# EAGLE design fnir_motherboard (EAGLE 6.1)
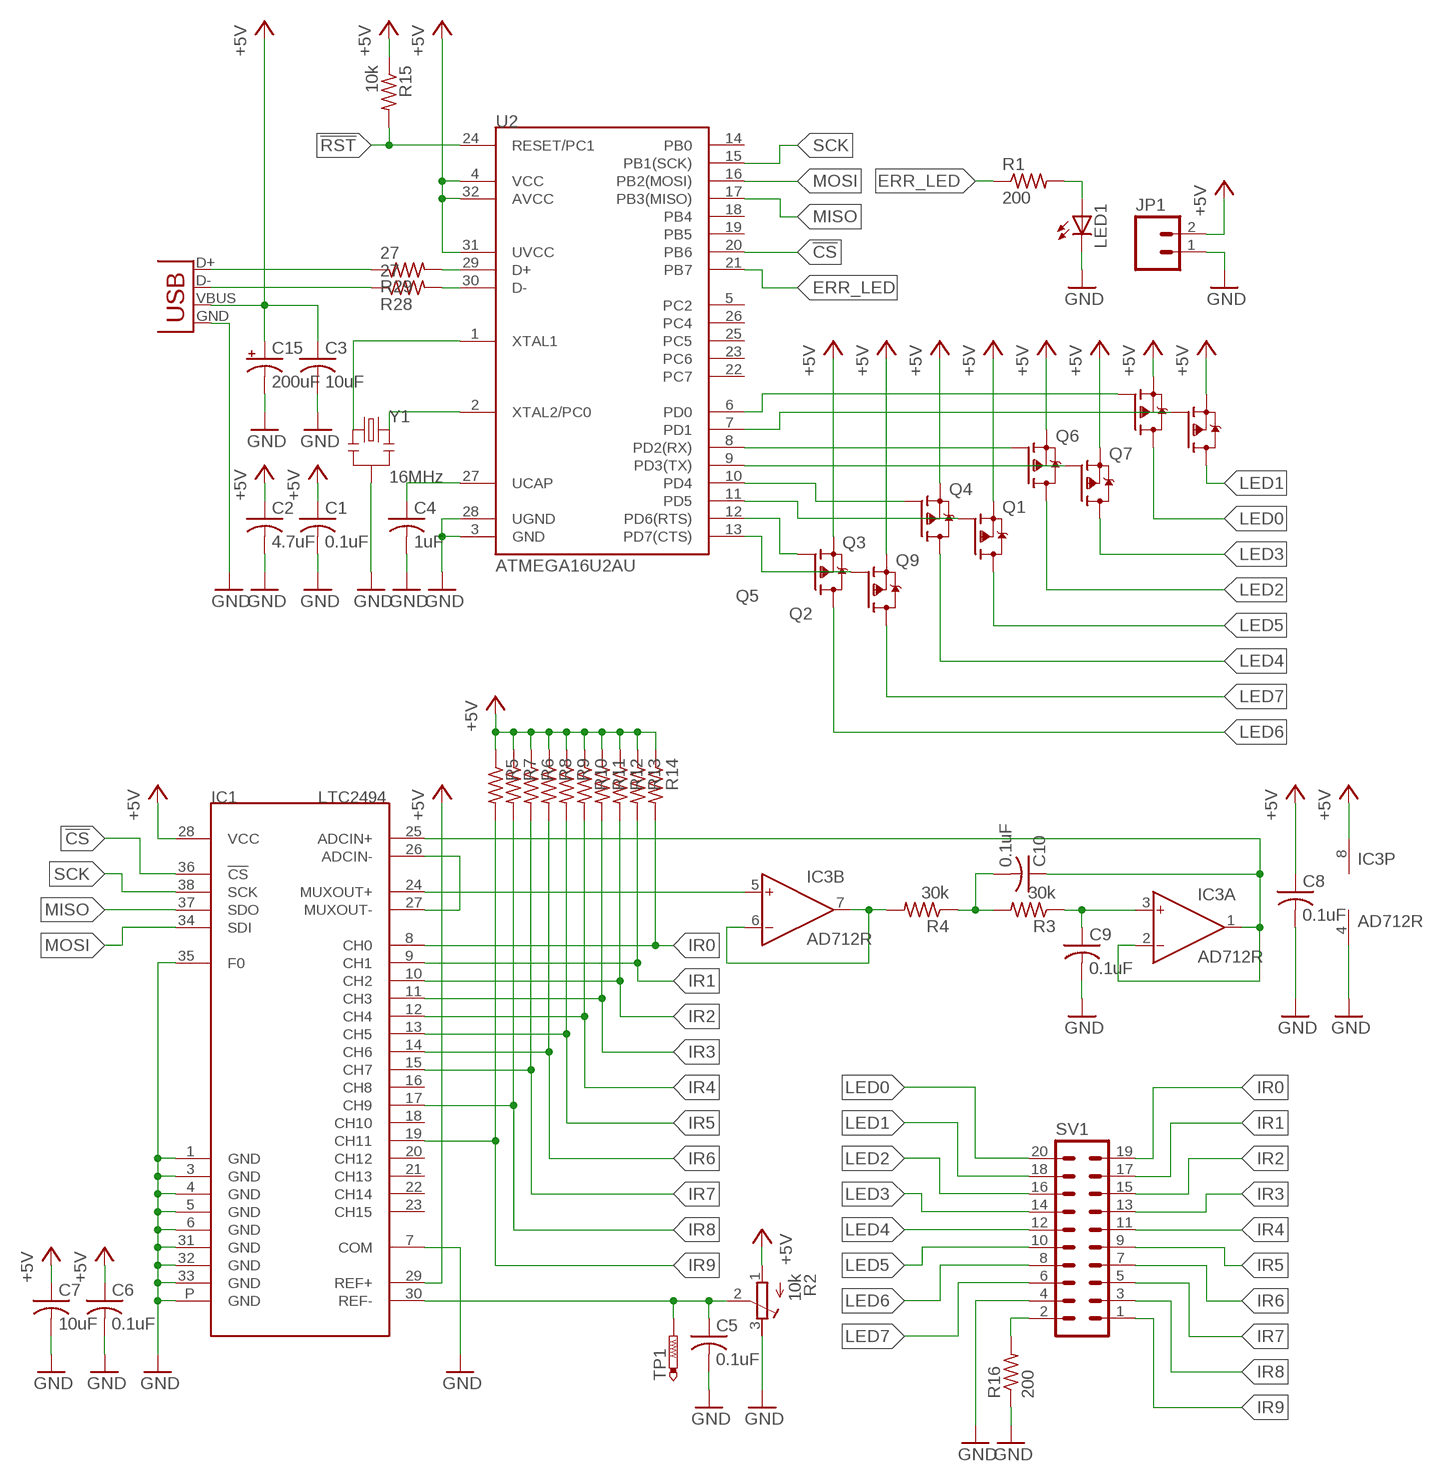
[diagram p0: schematic, sheet 1]

## Parts
C1  0.1uF  C-USC1206  [C1206]
C2  4.7uF  C-USC1206  [C1206]
C3  10uF  C-USC1206  [C1206]
C4  1uF  C-USC1206  [C1206]
C5  0.1uF  C-USC1206  [C1206]
C6  0.1uF  C-USC1206  [C1206]
C7  10uF  C-USC1206  [C1206]
C8  0.1uF  C-USC1206  [C1206]
C9  0.1uF  C-USC1206  [C1206]
C10  0.1uF  C-USC1206  [C1206]
C15  200uF  CPOL-USD  [PANASONIC_D]
IC1  LTC2494  [QFN38-7X12]
IC3  AD712R  [SO8]
JP1  M02PTH  [1X02]
LED1  LEDCHIPLED_1206  [CHIPLED_1206]
Q1  TRANSISTOR_FET_TSM2301CX  [SOT-23]
Q2  TRANSISTOR_FET_TSM2301CX  [SOT-23]
Q3  TRANSISTOR_FET_TSM2301CX  [SOT-23]
Q4  TRANSISTOR_FET_TSM2301CX  [SOT-23]
Q5  TRANSISTOR_FET_TSM2301CX  [SOT-23]
Q6  TRANSISTOR_FET_TSM2301CX  [SOT-23]
Q7  TRANSISTOR_FET_TSM2301CX  [SOT-23]
Q9  TRANSISTOR_FET_TSM2301CX  [SOT-23]
R1  200  R-US_R1206  [R1206]
R2  10k  R-TRIMM3304W  [RTRIM3304W]
R3  30k  R-US_R1206  [R1206]
R4  30k  R-US_R1206  [R1206]
R5  R-US_R1206  [R1206]
R6  R-US_R1206  [R1206]
R7  R-US_R1206  [R1206]
R8  R-US_R1206  [R1206]
R9  R-US_R1206  [R1206]
R10  R-US_R1206  [R1206]
R11  R-US_R1206  [R1206]
R12  R-US_R1206  [R1206]
R13  R-US_R1206  [R1206]
R14  R-US_R1206  [R1206]
R15  10k  R-US_R1206  [R1206]
R16  200  R-US_R1206  [R1206]
R28  27  R-US_R1206  [R1206]
R29  27  R-US_R1206  [R1206]
SV1  MA10-2  [MA10-2]
TP1  PTR1B1,27  [B1,27]
U2  ATMEGA16U2AU  ATMEGA8U2AU  [TQFP32-08]
X2  USB-SMD-NS  [USB-MINIB-NOSTOP]
Y1  16MHz  RESONATORSMD  [RESONATOR-SMD]

## Nets
!CS: IC1.36(!CS) U2.20(PB6)
!RST: R15.2 U2.24(RESET/PC1)
+5V: C1.1 C2.1 C3.1 C6.1 C7.1 C8.1 C15.+ IC1.28(VCC) IC1.29(REF+) IC3.8(P:V+) JP1.2 Q1.2(S) Q2.2(S) Q3.2(S) Q4.2(S) Q5.2(S) Q6.2(S) Q7.2(S) Q9.2(S) R2.1(A) R5.1 R6.1 R7.1 R8.1 R9.1 R10.1 R11.1 R12.1 R13.1 R14.1 R15.1 U2.4(VCC) U2.31(UVCC) U2.32(AVCC) X2.VBUS
D+: R29.1 X2.D+
D-: R28.1 X2.D-
ERR_LED: R1.1 U2.21(PB7)
GND: C1.2 C2.2 C3.2 C4.2 C5.2 C6.2 C7.2 C8.2 C9.2 C15.- IC1.1(GND) IC1.3(GND) IC1.4(GND) IC1.5(GND) IC1.6(GND) IC1.7(COM) IC1.31(GND) IC1.32(GND) IC1.33(GND) IC1.35(F0) IC1.P(GND) IC3.4(P:V-) JP1.1 LED1.C R2.3(E) R16.1 SV1.4 U2.3(GND) U2.28(UGND) X2.GND Y1.2
IR0: IC1.8(CH0) R14.2 SV1.19
IR1: IC1.9(CH1) R13.2 SV1.17
IR2: IC1.10(CH2) R12.2 SV1.15
IR3: IC1.11(CH3) R11.2 SV1.13
IR4: IC1.12(CH4) R10.2 SV1.11
IR5: IC1.13(CH5) R9.2 SV1.9
IR6: IC1.14(CH6) R8.2 SV1.7
IR7: IC1.15(CH7) R6.2 SV1.5
IR8: IC1.17(CH9) R7.2 SV1.3
IR9: IC1.19(CH11) R5.2 SV1.1
LED0: Q6.3(D) SV1.20
LED1: Q7.3(D) SV1.18
LED2: Q4.3(D) SV1.16
LED3: Q1.3(D) SV1.14
LED4: Q3.3(D) SV1.12
LED5: Q9.3(D) SV1.10
LED6: Q5.3(D) SV1.8
LED7: Q2.3(D) SV1.6
MISO: IC1.37(SDO) U2.17(PB3(MISO))
MOSI: IC1.34(SDI) U2.16(PB2(MOSI))
N$1: Q2.1(G) U2.13(PD7(CTS))
N$2: Q1.1(G) U2.9(PD3(TX))
N$3: Q9.1(G) U2.11(PD5)
N$4: Q4.1(G) U2.8(PD2(RX))
N$5: Q5.1(G) U2.12(PD6(RTS))
N$6: Q7.1(G) U2.7(PD1)
N$7: Q6.1(G) U2.6(PD0)
N$8: Q3.1(G) U2.10(PD4)
N$9: IC1.26(ADCIN-) IC1.27(MUXOUT-)
N$10: IC1.24(MUXOUT+) IC3.5(B:IN+)
N$11: C10.1 IC1.25(ADCIN+) IC3.1(A:OUT) IC3.2(A:IN-)
N$12: C5.1 IC1.30(REF-) R2.2(S) TP1.TP
N$13: C9.1 IC3.3(A:IN+) R3.1
N$14: R28.2 U2.30(D-)
N$15: R29.2 U2.29(D+)
N$16: C10.2 R3.2 R4.1
N$17: C4.1 U2.27(UCAP)
N$18: IC3.6(B:IN-) IC3.7(B:OUT) R4.2
N$19: U2.2(XTAL2/PC0) Y1.3
N$20: U2.1(XTAL1) Y1.1
N$21: LED1.A R1.2
N$23: R16.2 SV1.2
SCK: IC1.38(SCK) U2.15(PB1(SCK))
Unconnected: IC1.16(CH8) IC1.18(CH10) IC1.20(CH12) IC1.21(CH13) IC1.22(CH14) IC1.23(CH15) U2.5(PC2) U2.14(PB0) U2.18(PB4) U2.19(PB5) U2.22(PC7) U2.23(PC6) U2.25(PC5) U2.26(PC4)

## Library data of the parts
C1-C10 = adafruit:C-US: CAPACITOR, American symbol
C15 = adafruit:CPOL-US: POLARIZED CAPACITOR, American symbol
IC1 = linear-technology:LTC2494: 16 bit 16 ch adc
IC3 = analog-devices:AD712: Dual Precision, Low Cost, High Speed BiFET Op Amp Source: http://www.analog.com/static/imported-files/data_sheets/AD712.pdf; MF: ALTERA CORPORATION; MPN: AD712KRZ; OC_FARNELL: 1263975; OC_NEWARK: 59K4556
JP1 = sparkfun:M02: Header 2 Standard 2-pin 0.1" header. Use with straight break away headers (SKU : PRT-00116), right angle break away headers (PRT-00553), swiss pins (PRT-00743), machine pins (PRT-00117), and female headers (PRT-00115). Molex polarized connector foot print use with SKU : PRT-08233 with associated crimp pins and housings.
LED1 = adafruit:LED: LED OSRAM: - CHIPLED LG R971, LG N971, LY N971, LG Q971, LY Q971, LO R971, LY R971 LH N974, LH R974 LS Q976, LO Q976, LY Q976 LO Q996 - Hyper CHIPLED LW Q18S LB Q993, LB Q99A, LB R99A - SideLED LS A670, LO A670, LY A670, LG A670, LP A670 LB A673, LV A673, LT A673, LW A673 LH A674 LY A675 LS A676, LA A676, LO A676, LY A676, LW A676 LS A679, LY A679, LG A679 - Hyper Micro SIDELED® LS Y876, LA Y876, LO Y876, LY Y876 LT Y87S - SmartLED LW L88C, LW L88S LB L89C, LB L89S, LG L890 LS L89K, LO L89K, LY L89K LS L896, LA L896, LO L896, LY L896 - TOPLED LS T670, LO T670, LY T670, LG T670, LP T670 LSG T670, LSP T670, LSY T670, LOP T670, LYG T670 LG T671, LOG T671, LSG T671 LB T673, LV T673, LT T673, LW T673 LH T674 LS T676, LA T676, LO T676, LY T676, LB T676, LH T676, LSB T676, LW T676 LB T67C, LV T67C, LT T67C, LS T67K, LO T67K, LY T67K, LW E67C LS E67B, LA E67B, LO E67B, LY E67B, LB E67C, LV E67C, LT E67C LW T67C LS T679, LY T679, LG T679 LS T770, LO T770, LY T770, LG T770, LP T770 LB T773, LV T773, LT T773, LW T773 LH T774 LS E675, LA E675, LY E675, LS T675 LS T776, LA T776, LO T776, LY T776, LB T776 LHGB T686 LT T68C, LB T68C - Hyper Mini TOPLED® LB M676 - Mini TOPLED Santana® LG M470 LS M47K, LO M47K, LY M47K Source: http://www.osram.convergy.de/
Q1-Q7 Q9 = dp_devices:TRANSISTOR_FET_TSM2301CX: 20V P-Channel Enhancement Mode MOSFET
R1 R3-R16 R28 R29 = adafruit:R-US_: RESISTOR, American symbol
R2 = rcl:R-TRIMM: Trimm resistor
SV1 = con-lstb:MA10-2: PIN HEADER; OC_FARNELL: unknown; OC_NEWARK: unknown
TP1 = testpad:PTR1: TEST PIN
U2 = sparkfun:ATMEGA8U2: Atmel 8-bit Microcontroller with 8/16/32K Bystes of ISP Flash and USB Controller. ATmega8U2, ATmega16U2, and ATmega32U2
X2 = sparkfun:USB: USB Connectors USB-B-PTH is fully proven SKU : PRT-00139 USB-miniB is fully proven SKU : PRT-00587 USB-A-PCB is untested. USB-A-H is throughly reviewed, but untested. Spark Fun Electronics SKU : PRT-00437 USB-B-SMT is throughly reviewed, but untested. Needs silkscreen touching up. USB-A-S has not been used/tested USB-MB-H has not been used/tested
Y1 = sparkfun:RESONATOR: Resonator Small SMD resonator. This is the itty bitty 10/20MHz resonators with built in caps. CSTCE10M0G55 and CSTCE20M0V53. Footprint has been reviewed closely but hasn't been tested yet.

## Board
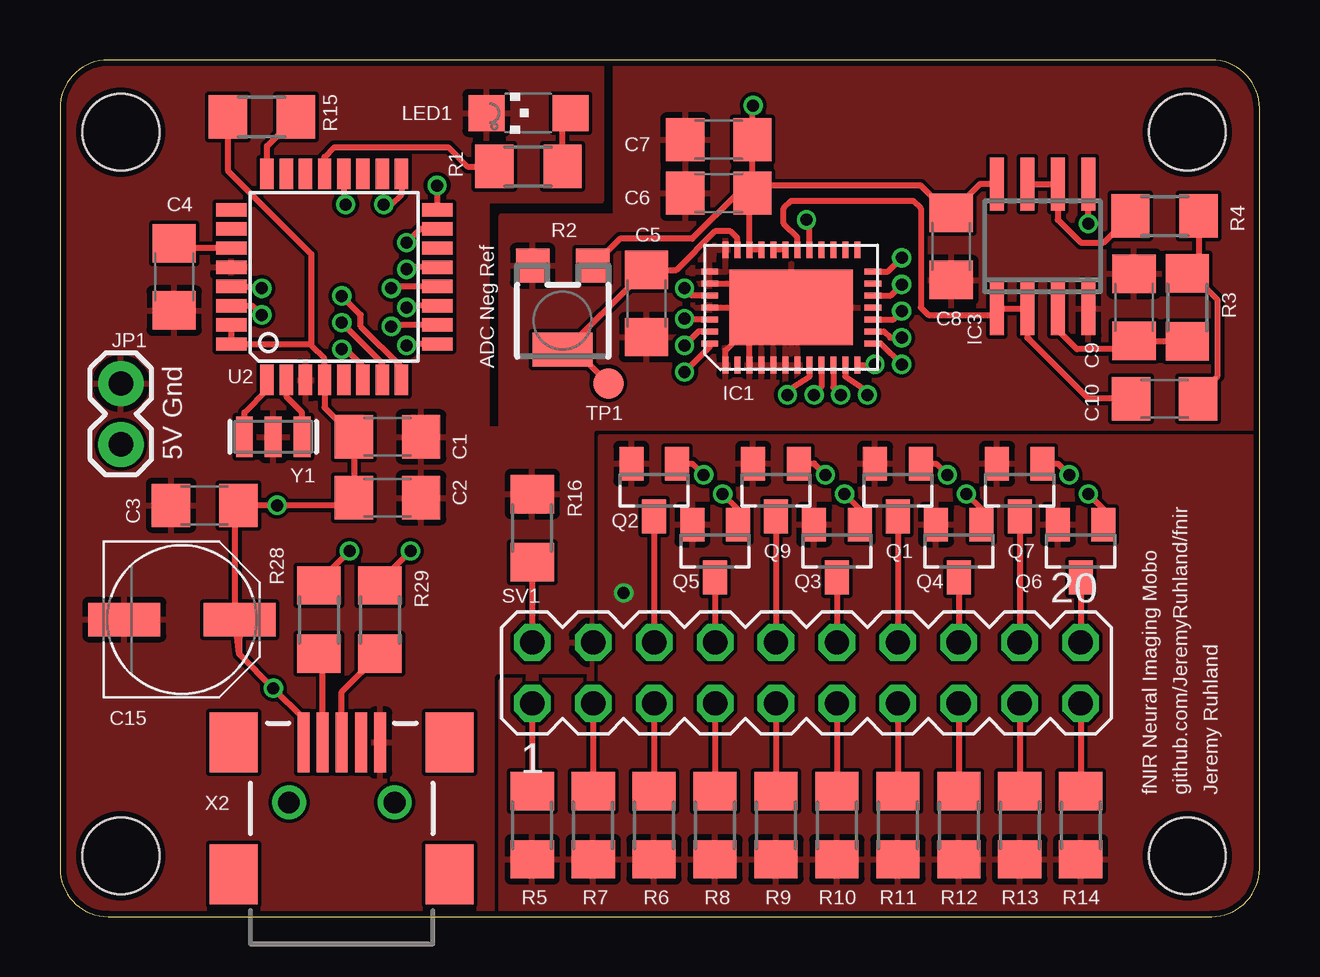
[diagram p1: board, top side]
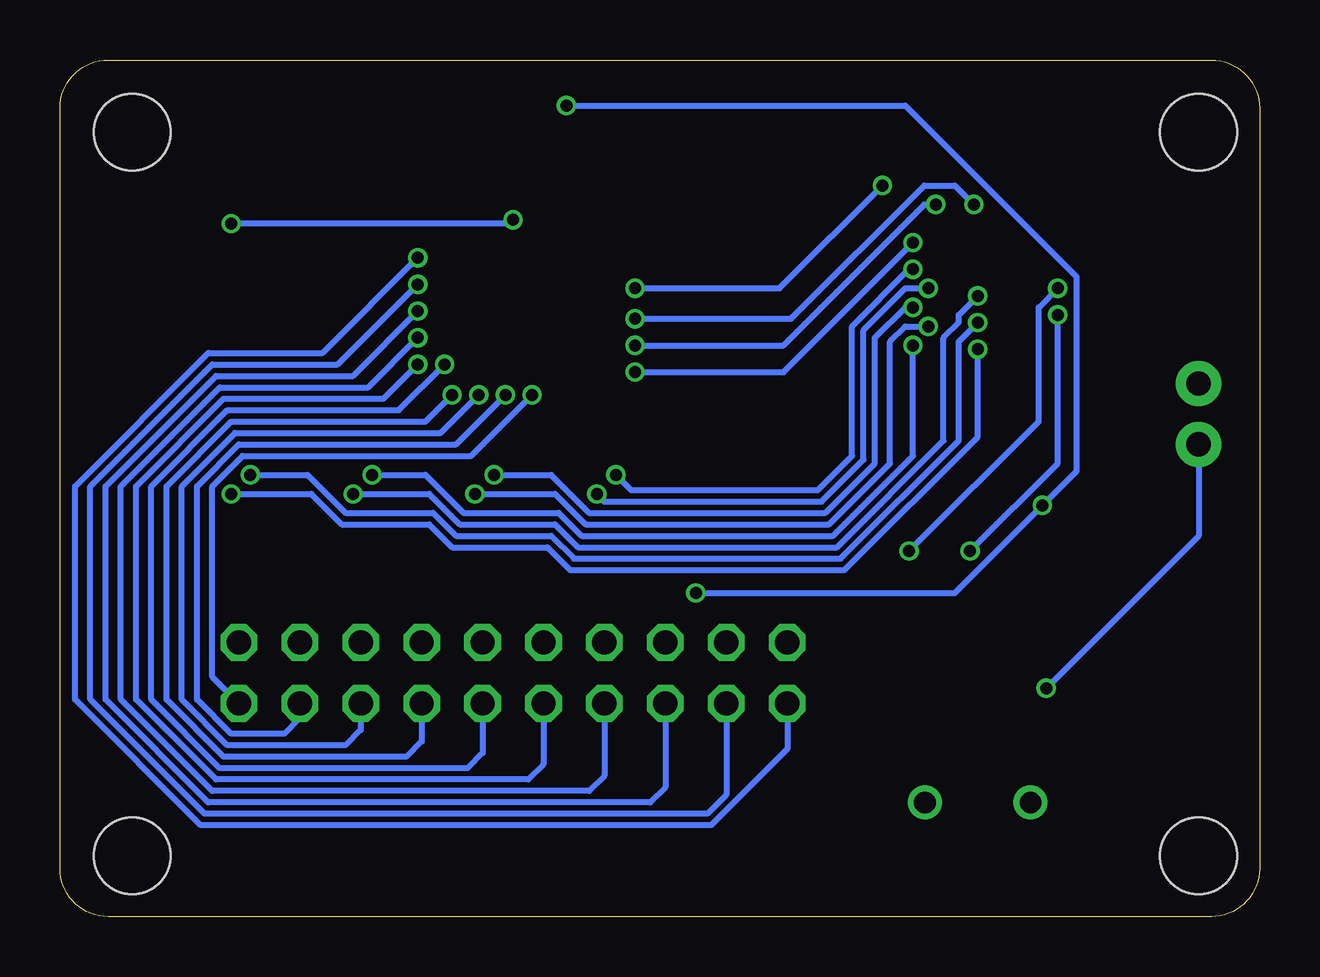
[diagram p2: board, bottom side, seen from below]

Size 50 x 35.71 mm. Coordinates in mm from the lower left corner, seen from the top.
Outline: 48,35.71 2,35.71 arc90 0,33.71 0,2 arc90 2,0 48,0 arc90 50,2 50,33.71 arc90 48,35.71
Copper layers (1*16): Top 0.035mm / dielectric 1.5mm / Bottom 0.035mm
Design rules: minimum track width 6mil, minimum drill 12mil, track to track 6mil, track to pad 6mil, pad to pad 6mil, via to via 6mil, smd to smd 0mil, copper to edge 10mil, drill to drill 10mil, minimum pad ring 10mil, minimum via ring 6mil, stop-mask expansion 2mil, vias tented up to drill 100mil, thermal gap 10mil
Holes 3.2 mm at 46.99,2.54 2.54,2.54 2.54,32.7 46.99,32.7

### Footprints (pad centres in the part's own frame; a part is rotated, then mirrored left to right if it is on the bottom)
C1206 = smd 1.6 x 1.8: 1 -1.4,0; 2 1.4,0
PANASONIC_D = smd 3 x 1.4: + 2.4,0; - -2.4,0
QFN38-7X12 = smd 0.25 x 0.7: 1 -2.75,-2.4; 2 -2.25,-2.4; 3 -1.75,-2.4; 4 -1.25,-2.4; 5 -0.75,-2.4; 6 -0.25,-2.4; 7 0.25,-2.4; 8 0.75,-2.4; 9 1.25,-2.4; 10 1.75,-2.4; 11 2.25,-2.4; 12 2.75,-2.4; 20 2.75,2.4; 21 2.25,2.4; 22 1.75,2.4; 23 1.25,2.4; 24 0.75,2.4; 25 0.25,2.4; 26 -0.25,2.4; 27 -0.75,2.4; 28 -1.25,2.4; 29 -1.75,2.4; 30 -2.25,2.4; 31 -2.75,2.4 | smd 0.7 x 0.25: 13 3.4,-1.5; 14 3.4,-1; 15 3.4,-0.5; 16 3.4,0; 17 3.4,0.5; 18 3.4,1; 19 3.4,1.5; 32 -3.4,1.5; 33 -3.4,1; 34 -3.4,0.5; 35 -3.4,0; 36 -3.4,-0.5; 37 -3.4,-1; 38 -3.4,-1.5 | smd 5.15 x 3.15: P 0,0
SO8 = smd 0.6 x 2.2: 1 -1.905,-2.6; 2 -0.635,-2.6; 3 0.635,-2.6; 4 1.905,-2.6; 5 1.905,2.6; 6 0.635,2.6; 7 -0.635,2.6; 8 -1.905,2.6
1X02 = drill 1.016 pad 1.88: 1 0,0; 2 2.54,0
CHIPLED_1206 = smd 1.5 x 1.5: A 0,-1.75; C 0,1.75
SOT-23 = smd 1 x 1.4: 1 -0.95,-1.1; 2 0.95,-1.1; 3 0,1.1
R1206 = smd 1.6 x 1.803: 1 -1.422,0; 2 1.422,0
RTRIM3304W = smd 1.4 x 1.4: 1 -1.25,-1.9; 3 1.25,-1.9 | smd 2.5 x 1.4: 2 0,1.6
MA10-2 = drill 1.016 octagon: 1 -11.43,-1.27; 2 -11.43,1.27; 3 -8.89,-1.27; 4 -8.89,1.27; 5 -6.35,-1.27; 6 -6.35,1.27; 7 -3.81,-1.27; 8 -3.81,1.27; 9 -1.27,-1.27; 10 -1.27,1.27; 11 1.27,-1.27; 12 1.27,1.27; 13 3.81,-1.27; 14 3.81,1.27; 15 6.35,-1.27; 16 6.35,1.27; 17 8.89,-1.27; 18 8.89,1.27; 19 11.43,-1.27; 20 11.43,1.27
B1,27 = smd 1.27 x 1.27: TP 0,0
TQFP32-08 = smd 1.27 x 0.559: 1 -4.293,2.8; 2 -4.293,2; 3 -4.293,1.2; 4 -4.293,0.4; 5 -4.293,-0.4; 6 -4.293,-1.2; 7 -4.293,-2; 8 -4.293,-2.8; 17 4.293,-2.8; 18 4.293,-2; 19 4.293,-1.2; 20 4.293,-0.4; 21 4.293,0.4; 22 4.293,1.2; 23 4.293,2; 24 4.293,2.8 | smd 0.559 x 1.27: 9 -2.8,-4.293; 10 -2,-4.293; 11 -1.2,-4.293; 12 -0.4,-4.293; 13 0.4,-4.293; 14 1.2,-4.293; 15 2,-4.293; 16 2.8,-4.293; 25 2.8,4.293; 26 2,4.293; 27 1.2,4.293; 28 0.4,4.293; 29 -0.4,4.293; 30 -1.2,4.293; 31 -2,4.293; 32 -2.8,4.293
USB-MINIB-NOSTOP = smd 2.5 x 0.5: D+ 2.5,0; D- 2.5,0.8; GND 2.5,-1.6; ID 2.5,-0.8; VBUS 2.5,1.6 | smd 2.5 x 2: G1 -3,-4.5; G2 -3,4.5; G3 2.5,4.5; G4 2.5,-4.5 | drill 0.9 pad 0.8: H1 0,2.2 | drill 0.9 pad 0.787: H2 0,-2.2
RESONATOR-SMD = smd 0.7 x 1.7: 1 -1.2,0; 2 0,0; 3 1.2,0

### Placement (x,y rotation side)
C1  13.65,20 0 top
C2  13.65,17.46 0 top
C3  6.03,17.14 180 top
C4  4.76,26.67 270 top
C5  24.45,25.56 270 top
C6  27.46,30.16 180 top
C7  27.46,32.38 180 top
C8  37.15,27.94 270 top
C9  44.77,25.4 90 top
C10  46.04,21.59 0 top
C15  5.08,12.38 0 top
IC1  30.48,25.4 0 top
IC3  40.96,27.94 0 top
JP1  2.54,22.23 270 top
LED1  19.53,33.5 90 top
Q1  34.92,17.78 180 top
Q2  24.77,17.78 180 top
Q3  32.38,15.24 180 top
Q4  37.47,15.24 180 top
Q5  27.3,15.24 180 top
Q6  42.55,15.24 180 top
Q7  40.01,17.78 180 top
Q9  29.84,17.78 180 top
R1  19.53,31.27 0 top
R2  20.95,25.24 180 top
R3  46.99,25.4 90 top
R4  46.04,29.21 180 top
R5  19.68,3.81 90 top
R6  24.77,3.81 90 top
R7  22.23,3.81 90 top
R8  27.3,3.81 90 top
R9  29.84,3.81 90 top
R10  32.38,3.81 90 top
R11  34.92,3.81 90 top
R12  37.47,3.81 90 top
R13  40.01,3.81 90 top
R14  42.55,3.81 90 top
R15  8.41,33.34 0 top
R16  19.68,16.19 270 top
R28  10.79,12.38 90 top
R29  13.34,12.38 90 top
SV1  31.11,10.16 0 top
TP1  22.86,22.23 0 top
U2  11.43,26.67 90 top
X2  11.75,4.76 90 top
Y1  8.89,20 0 top

### Tracks (layer width: path | path; a pad name or v marks a point on that pad's centre or on a via)
!CS  (via drill 0.5)
  Top 0.254: IC1.36 26.06,24.9 v26.04,24.92 | U2.20 11.83,29.76 v11.91,29.69
  Bottom 0.254: v26.04,24.92 19.53,24.92 13.97,30.48 12.7,30.48 v11.91,29.69
!RST
  Top 0.254: U2.24 8.63,32.12 R15.2
+5V  (via drill 0.5)
  Top 0.254: IC3.8 38.35,30.54 C8.1 arc-45 36.93,29.43 35.88,30.48 28.89,30.48 28.89,30.19 C6.1 | U2.31 U2.32 10.42,23.87 10.48,23.81 | 10.48,23.81 11.03,23.26 U2.4 11.03,21.23 C1.1 C2.1 11.94,17.14 v9.05,17.14 C3.1 7.3,17.14 7.3,12.38 7.46,10.95 | X2.VBUS 10.15,8.27 v8.89,9.53 7.46,10.95 | 10.48,23.81 10.48,27.62 6.99,31.11 R15.1 | IC1.29 IC1.28 IC1.29 28.73,30.03 C6.1 | C6.1 28.26,30.16 26.35,28.26 23.34,28.26 22.23,27.15 R2.1 | C6.1 28.89,30.16 | C6.1 C7.1 28.86,33.78 v28.89,33.81 | C15.+ 7.48,12.24 7.46,10.95
  Bottom 0.254: v23.5,13.49 12.7,13.49 v9.05,17.14 7.62,18.57 7.62,26.67 14.76,33.81 v28.89,33.81 | JP1.2 2.54,15.88 v8.89,9.53
  pour Top: 49.85,20 49.85,0 18.41,0 18.41,9.84 22.54,9.84 22.54,20
D+
  Top 0.254: X2.D+ 11.75,9.37 R29.1
D-
  Top 0.254: X2.D- 10.95,10.64 10.79,10.79 R28.1
ERR_LED
  Top 0.254: U2.21 11.03,31.67 11.43,32.07 16.19,32.07 16.99,31.27 R1.1
GND
  Top 0.254: 27.94,26.4 28.15,26.4 | 28.15,26.4 28.26,26.51 | IC1.33 27.94,26.4 | 28.15,26.4 28.37,26.4 28.42,26.35 | IC1.1 27.73,23.6 28.42,24.29 | 28.42,24.29 28.57,24.45 28.57,25.08 28.26,25.4 | IC1.3 28.73,23.98 28.42,24.29 | IC1.35 28.26,25.4 | 28.26,25.4 28.26,26.08 27.94,26.4
  pour Top (rank 3): 0,35.71 22.54,35.71 22.54,29.84 17.78,29.84 17.78,20.32 18.41,20.32 18.41,29.21 23.18,29.21 23.18,35.71 50,35.71 50,0 0,0
IR0  (via drill 0.5)
  Top 0.254: IC1.8 31.23,22.5 30.32,21.91 v30.32,21.75 | SV1.19 R14.2
  Bottom 0.254: SV1.19 43.66,10 43.66,17.94 42.39,19.21 32.86,19.21 v30.32,21.75
IR1  (via drill 0.5)
  Top 0.254: IC1.9 31.73,22.09 v31.43,21.75 | SV1.17 R13.2
  Bottom 0.254: SV1.17 40.01,8.26 40.64,7.62 42.86,7.62 44.29,9.05 44.29,17.94 42.55,19.68 33.5,19.68 v31.43,21.75
IR2  (via drill 0.5)
  Top 0.254: IC1.10 32.23,22.06 v32.54,21.75 | SV1.15 R12.2
  Bottom 0.254: SV1.15 37.47,7.78 38.1,7.14 43.02,7.14 44.93,9.05 44.93,17.94 42.7,20.16 34.13,20.16 v32.54,21.75
IR3  (via drill 0.5)
  Top 0.254: IC1.11 32.73,22.52 33.66,21.91 v33.66,21.75 | SV1.13 R11.2
  Bottom 0.254: SV1.13 34.92,7.3 35.56,6.67 43.18,6.67 45.56,9.05 45.56,17.94 42.86,20.64 34.77,20.64 v33.66,21.75
IR4  (via drill 0.5)
  Top 0.254: IC1.12 33.95,23 v33.97,23.02 | SV1.11 R10.2
  Bottom 0.254: SV1.11 32.38,6.83 33.02,6.19 43.34,6.19 46.2,9.05 46.2,17.94 43.02,21.11 35.88,21.11 v33.97,23.02
IR5  (via drill 0.5)
  Top 0.254: SV1.9 R9.2 | IC1.13 34.2,23.9 v35.08,23.02
  Bottom 0.254: SV1.9 29.84,6.35 30.48,5.71 43.5,5.71 46.83,9.05 46.83,17.94 43.18,21.59 36.51,21.59 v35.08,23.02
IR6  (via drill 0.5)
  Top 0.254: SV1.7 R8.2 | IC1.14 34.34,24.4 34.61,24.13 v35.08,24.13
  Bottom 0.254: SV1.7 27.3,5.87 27.94,5.24 43.66,5.24 47.47,9.05 47.47,17.94 43.34,22.07 37.15,22.07 v35.08,24.13
IR7  (via drill 0.5)
  Top 0.254: SV1.5 R6.2 | IC1.15 34.74,24.9 v35.08,25.24
  Bottom 0.254: SV1.5 24.77,5.4 25.4,4.76 43.81,4.76 48.1,9.05 48.1,17.94 43.5,22.54 37.78,22.54 v35.08,25.24
IR8  (via drill 0.5)
  Top 0.254: SV1.3 R7.2 | IC1.17 34.63,25.9 v35.08,26.35
  Bottom 0.254: SV1.3 22.23,5.08 23.02,4.29 43.97,4.29 48.74,9.05 48.74,17.94 43.66,23.02 38.42,23.02 v35.08,26.35
IR9  (via drill 0.5)
  Top 0.254: SV1.1 R5.2 | IC1.19 34.52,26.89 v35.08,27.46
  Bottom 0.254: SV1.1 19.68,6.99 22.86,3.81 44.13,3.81 49.37,9.05 49.37,17.94 43.81,23.5 39.05,23.5 v35.08,27.46
LED0
  Top 0.254: Q6.3 SV1.20
LED1
  Top 0.254: Q7.3 SV1.18
LED2
  Top 0.254: Q4.3 SV1.16
LED3
  Top 0.254: Q1.3 SV1.14
LED4
  Top 0.254: Q3.3 SV1.12
LED5
  Top 0.254: Q9.3 SV1.10
LED6
  Top 0.254: Q5.3 SV1.8
LED7
  Top 0.254: Q2.3 SV1.6
MISO  (via drill 0.5)
  Top 0.254: IC1.37 26.62,24.4 v26.04,23.81 | U2.17 14.23,30.11 13.81,29.69 v13.49,29.69
  Bottom 0.254: v26.04,23.81 19.84,23.81 13.97,29.69 v13.49,29.69
MOSI  (via drill 0.5)
  Top 0.254: IC1.34 26.33,25.9 v26.04,26.19 | v15.72,30.48 U2.16
  Bottom 0.254: v26.04,26.19 20,26.19 v15.72,30.48
N$1  (via drill 0.5)
  Top 0.254: Q2.1 26.36,18.88 v26.83,18.41 | U2.13 14.53,27.07 v14.45,26.99
  Bottom 0.254: v26.83,18.41 26.19,17.78 18.41,17.78 16.99,19.21 16.99,24.61 14.61,26.99 v14.45,26.99
N$2  (via drill 0.5)
  Top 0.254: U2.9 14.5,23.87 v14.45,23.81 | Q1.1 36.52,18.88 v36.99,18.41
  Bottom 0.254: v36.99,18.41 34.77,18.41 33.18,16.83 29.21,16.83 28.26,15.88 17.78,15.88 14.45,19.21 v14.45,23.81
N$3  (via drill 0.5)
  Top 0.254: U2.11 14.52,25.47 v14.45,25.4 | Q9.1 31.42,18.88 31.43,18.89 v31.91,18.41
  Bottom 0.254: v31.91,18.41 29.53,18.41 27.94,16.83 18.1,16.83 16.03,18.89 16.03,24.13 14.76,25.4 v14.45,25.4
N$4  (via drill 0.5)
  Top 0.254: U2.8 14.23,22.92 12.54,24.61 12.54,25.08 v11.75,25.88 | Q4.1 38.41,16.98 38.42,16.99 v37.78,17.62
  Bottom 0.254: v37.78,17.62 34.61,17.62 33.34,16.35 29.37,16.35 28.42,15.4 17.62,15.4 13.18,19.84 13.18,24.13 12.54,24.77 12.54,25.08 v11.75,25.88
N$5  (via drill 0.5)
  Top 0.254: Q5.1 28.25,16.99 v27.62,17.62 | U2.12 13.89,26.27 v13.81,26.19
  Bottom 0.254: v27.62,17.62 27.3,17.3 18.26,17.3 16.51,19.05 16.51,24.45 14.76,26.19 v13.81,26.19
N$6  (via drill 0.5)
  Top 0.254: U2.7 13.43,23.08 v11.75,24.77 | Q7.1 41.6,18.88 v42.07,18.41
  Bottom 0.254: v42.07,18.41 39.69,18.41 38.1,16.83 34.45,16.83 33.5,15.88 29.53,15.88 28.57,14.92 17.46,14.92 12.54,19.84 12.54,23.97 v11.75,24.77
N$7  (via drill 0.5)
  Top 0.254: U2.6 12.63,22.93 11.91,23.65 v11.75,23.65 | Q6.1 43.49,16.98 43.5,16.99 v42.86,17.62
  Bottom 0.254: v42.86,17.62 39.53,17.62 38.26,16.35 34.61,16.35 33.66,15.4 29.69,15.4 28.73,14.45 17.3,14.45 11.75,20 v11.75,23.65
N$8  (via drill 0.5)
  Top 0.254: U2.10 13.88,24.67 v13.81,24.61 | Q3.1 33.34,16.99 v32.7,17.62
  Bottom 0.254: v32.7,17.62 29.37,17.62 28.1,16.35 17.94,16.35 15.4,18.89 15.4,23.97 14.76,24.61 v13.81,24.61
N$9
  Top 0.254: IC1.26 IC1.27
N$10  (via drill 0.5)
  Top 0.254: IC1.24 31.23,28.94 v31.11,29.05 | v42.86,28.89 IC3.5
  Bottom 0.254: v31.11,29.05 31.27,28.89 v42.86,28.89
N$11
  Top 0.254: IC1.25 30.73,28.32 30.16,28.89 30.16,29.53 30.48,29.84 35.56,29.84 35.88,29.53 35.88,25.4 36.2,25.08 39.05,25.08 IC3.1 IC3.2 40.32,24.13 42.86,21.59 C10.1
N$12
  Top 0.254: IC1.30 28.23,28.29 27.94,28.57 27.3,28.57 25.69,26.96 C5.1 24.16,26.67 24.13,26.67 21.1,23.64 | R2.2 21.1,23.64 | 21.1,23.64 21.44,23.64 TP1.TP
N$13
  Top 0.254: R3.1 47.28,24 C9.1 44.64,24 44.29,23.65 42.39,23.65 41.59,24.45 IC3.3
N$14  (via drill 0.5)
  Top 0.254: U2.30 8.03,25.47 v8.41,25.08 | R28.2 10.79,13.97 v12.06,15.24
  Bottom 0.254: v12.06,15.24 8.41,18.89 v8.41,25.08
N$15  (via drill 0.5)
  Top 0.254: U2.29 8.34,26.27 v8.41,26.19 | R29.2 13.34,13.97 v14.61,15.24
  Bottom 0.254: v14.61,15.24 9.21,20.64 9.21,25.4 v8.41,26.19
N$16
  Top 0.254: R4.1 47.46,26.97 R3.2 47.31,26.67 48.26,25.72 48.26,22.54 47.44,21.72 C10.2
N$17
  Top 0.254: U2.27 5.15,27.87 4.95,28.07 C4.1
N$18
  Top 0.254: IC3.6 IC3.7 41.53,30.54 41.59,30.48 41.59,29.05 42.55,28.1 43.5,28.1 R4.2
N$19
  Top 0.254: Y1.3 10.09,21.02 9.43,21.68 U2.2
N$20
  Top 0.254: Y1.1 7.69,21.02 8.63,21.96 U2.1
N$21
  Top 0.254: R1.2 20.95,33.17 LED1.A
N$23
  Top 0.254: R16.2 SV1.2
SCK  (via drill 0.5)
  Top 0.254: IC1.38 27.08,23.75 v26.04,22.7 | U2.15 15.02,28.67 v14.45,28.1
  Bottom 0.254: v26.04,22.7 19.84,22.7 v14.45,28.1

### Text on the board
_tsilk: ADC Neg Ref | 5V Gnd | fNIR Neural Imaging Mobo | github.com/JeremyRuhland/fnir | Jeremy Ruhland